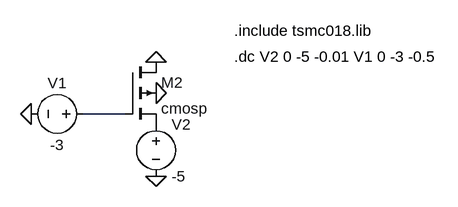
[diagram p0: schematic pmos.asc]
pmos.asc, the LTspice schematic file:
Version 4
SHEET 1 880 680
WIRE -176 -112 -240 -112
FLAG -320 -112 0
FLAG -128 -16 0
FLAG -128 -192 0
FLAG -128 -144 0
SYMBOL voltage -224 -112 R90
WINDOW 0 -32 56 VBottom 2
WINDOW 3 32 56 VTop 2
SYMATTR InstName V1
SYMATTR Value -3
SYMBOL voltage -128 -112 R0
SYMATTR InstName V2
SYMATTR Value -5
SYMBOL pmos4 -176 -192 R0
SYMATTR InstName M2
SYMATTR Value cmosp
TEXT -8 -200 Left 2 !.dc V2 0 -5 -0.01 V1 0 -3 -0.5
TEXT -8 -240 Left 2 !.include tsmc018.lib

The netlist it stands for:
* pmos.asc
V1 N001 0 -3
V2 P001 0 -5
M2 0 N001 P001 0 cmosp
.model NMOS NMOS
.model PMOS PMOS
.lib standard.mos
.dc V2 0 -5 -0.01 V1 0 -3 -0.5
.include tsmc018.lib
.backanno
.end